# EAGLE design DeMuxRow (EAGLE 6.6.0)
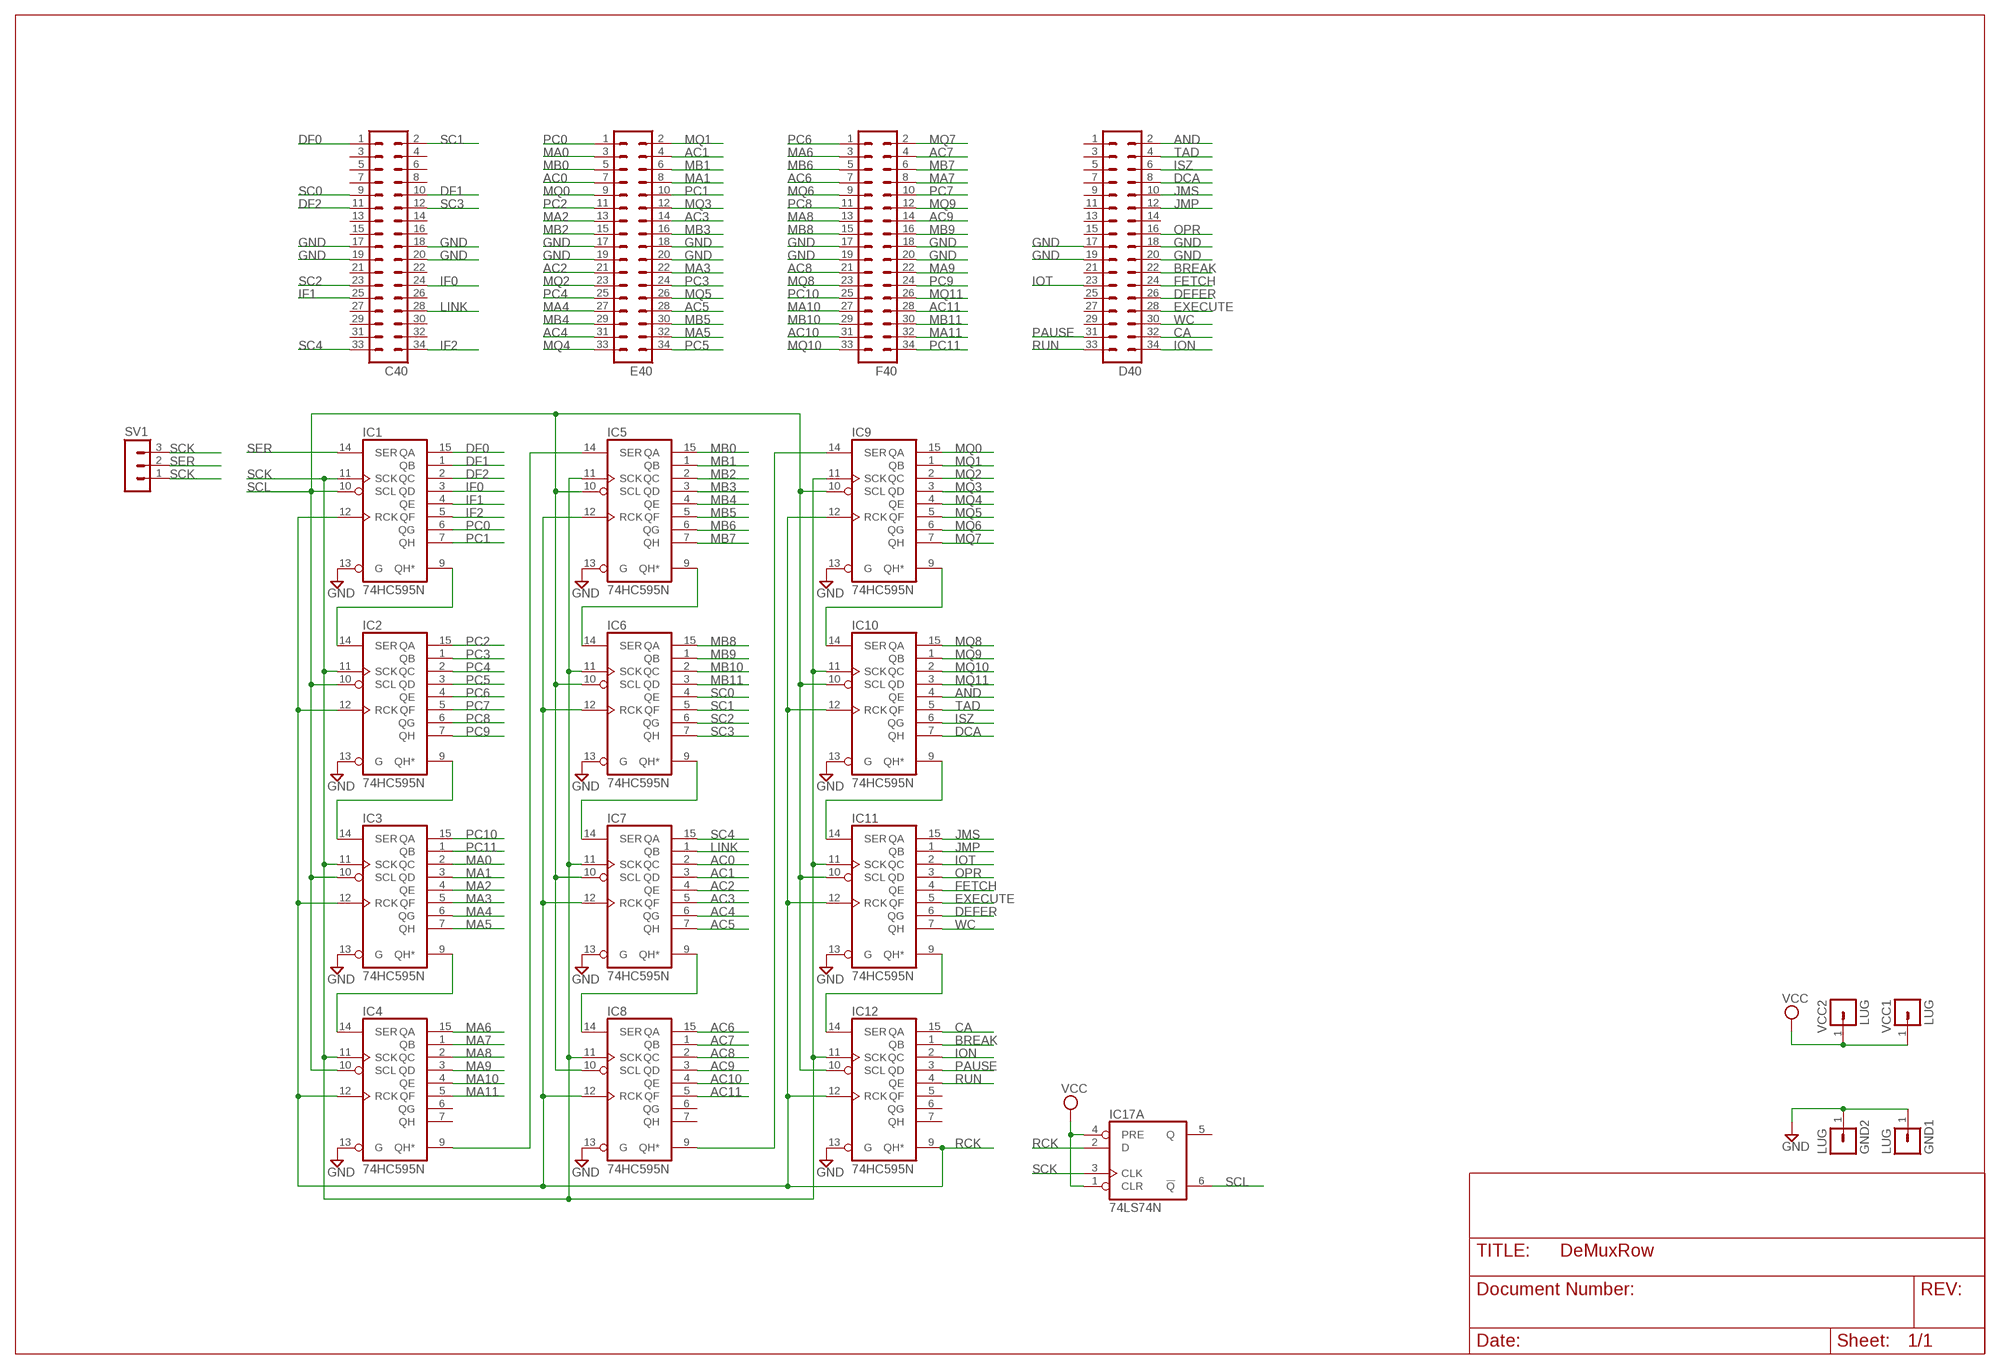
[diagram p0: schematic, sheet 1]

## Parts
C40  MA17-2  [MA17-2]
D40  MA17-2  [MA17-2]
E40  MA17-2  [MA17-2]
F40  MA17-2  [MA17-2]
GND1  LUG  [SPADELUG]
GND2  LUG  [SPADELUG]
IC1  74HC595N  74LS595N  [DIL16]
IC2  74HC595N  74LS595N  [DIL16]
IC3  74HC595N  74LS595N  [DIL16]
IC4  74HC595N  74LS595N  [DIL16]
IC5  74HC595N  74LS595N  [DIL16]
IC6  74HC595N  74LS595N  [DIL16]
IC7  74HC595N  74LS595N  [DIL16]
IC8  74HC595N  74LS595N  [DIL16]
IC9  74HC595N  74LS595N  [DIL16]
IC10  74HC595N  74LS595N  [DIL16]
IC11  74HC595N  74LS595N  [DIL16]
IC12  74HC595N  74LS595N  [DIL16]
IC17  74LS74N  [DIL14]
SV1  MA03-1  [MA03-1]
VCC1  LUG  [SPADELUG]
VCC2  LUG  [SPADELUG]

## Nets
AC0: E40.7 IC7.2(QC)
AC1: E40.4 IC7.3(QD)
AC2: E40.21 IC7.4(QE)
AC3: E40.14 IC7.5(QF)
AC4: E40.31 IC7.6(QG)
AC5: E40.28 IC7.7(QH)
AC6: F40.7 IC8.15(QA)
AC7: F40.4 IC8.1(QB)
AC8: F40.21 IC8.2(QC)
AC9: F40.14 IC8.3(QD)
AC10: F40.31 IC8.4(QE)
AC11: F40.28 IC8.5(QF)
AND: D40.2 IC10.4(QE)
BREAK: D40.22 IC12.1(QB)
CA: D40.32 IC12.15(QA)
DCA: D40.8 IC10.7(QH)
DEFER: D40.26 IC11.6(QG)
DF0: C40.1 IC1.15(QA)
DF1: C40.10 IC1.1(QB)
DF2: C40.11 IC1.2(QC)
EXECUTE: D40.28 IC11.5(QF)
FETCH: D40.24 IC11.4(QE)
GND [supply]: C40.17 C40.18 C40.19 C40.20 D40.17 D40.18 D40.19 D40.20 E40.17 E40.18 E40.19 E40.20 F40.17 F40.18 F40.19 F40.20 GND1.1 GND2.1 IC1.13(G) IC2.13(G) IC3.13(G) IC4.13(G) IC5.13(G) IC6.13(G) IC7.13(G) IC8.13(G) IC9.13(G) IC10.13(G) IC11.13(G) IC12.13(G)
IF0: C40.24 IC1.3(QD)
IF1: C40.25 IC1.4(QE)
IF2: C40.34 IC1.5(QF)
ION: D40.34 IC12.2(QC)
IOT: D40.23 IC11.2(QC)
ISZ: D40.6 IC10.6(QG)
JMP: D40.12 IC11.1(QB)
JMS: D40.10 IC11.15(QA)
LINK: C40.28 IC7.1(QB)
MA0: E40.3 IC3.2(QC)
MA1: E40.8 IC3.3(QD)
MA2: E40.13 IC3.4(QE)
MA3: E40.22 IC3.5(QF)
MA4: E40.27 IC3.6(QG)
MA5: E40.32 IC3.7(QH)
MA6: F40.3 IC4.15(QA)
MA7: F40.8 IC4.1(QB)
MA8: F40.13 IC4.2(QC)
MA9: F40.22 IC4.3(QD)
MA10: F40.27 IC4.4(QE)
MA11: F40.32 IC4.5(QF)
MB0: E40.5 IC5.15(QA)
MB1: E40.6 IC5.1(QB)
MB2: E40.15 IC5.2(QC)
MB3: E40.16 IC5.3(QD)
MB4: E40.29 IC5.4(QE)
MB5: E40.30 IC5.5(QF)
MB6: F40.5 IC5.6(QG)
MB7: F40.6 IC5.7(QH)
MB8: F40.15 IC6.15(QA)
MB9: F40.16 IC6.1(QB)
MB10: F40.29 IC6.2(QC)
MB11: F40.30 IC6.3(QD)
MQ0: E40.9 IC9.15(QA)
MQ1: E40.2 IC9.1(QB)
MQ2: E40.23 IC9.2(QC)
MQ3: E40.12 IC9.3(QD)
MQ4: E40.33 IC9.4(QE)
MQ5: E40.26 IC9.5(QF)
MQ6: F40.9 IC9.6(QG)
MQ7: F40.2 IC9.7(QH)
MQ8: F40.23 IC10.15(QA)
MQ9: F40.12 IC10.1(QB)
MQ10: F40.33 IC10.2(QC)
MQ11: F40.26 IC10.3(QD)
N$4: IC5.9(QH*) IC6.14(SER)
N$10: IC1.9(QH*) IC2.14(SER)
N$11: IC2.9(QH*) IC3.14(SER)
N$12: IC3.9(QH*) IC4.14(SER)
N$13: IC7.9(QH*) IC8.14(SER)
N$14: IC6.9(QH*) IC7.14(SER)
N$15: IC11.9(QH*) IC12.14(SER)
N$16: IC10.9(QH*) IC11.14(SER)
N$19: IC9.9(QH*) IC10.14(SER)
N$21: IC4.9(QH*) IC5.14(SER)
N$22: IC8.9(QH*) IC9.14(SER)
OPR: D40.16 IC11.3(QD)
PAUSE: D40.31 IC12.3(QD)
PC0: E40.1 IC1.6(QG)
PC1: E40.10 IC1.7(QH)
PC2: E40.11 IC2.15(QA)
PC3: E40.24 IC2.1(QB)
PC4: E40.25 IC2.2(QC)
PC5: E40.34 IC2.3(QD)
PC6: F40.1 IC2.4(QE)
PC7: F40.10 IC2.5(QF)
PC8: F40.11 IC2.6(QG)
PC9: F40.24 IC2.7(QH)
PC10: F40.25 IC3.15(QA)
PC11: F40.34 IC3.1(QB)
RCK: IC1.12(RCK) IC2.12(RCK) IC3.12(RCK) IC4.12(RCK) IC5.12(RCK) IC6.12(RCK) IC7.12(RCK) IC8.12(RCK) IC9.12(RCK) IC10.12(RCK) IC11.12(RCK) IC12.9(QH*) IC12.12(RCK) IC17.2(A:D)
RUN: D40.33 IC12.4(QE)
SC0: C40.9 IC6.4(QE)
SC1: C40.2 IC6.5(QF)
SC2: C40.23 IC6.6(QG)
SC3: C40.12 IC6.7(QH)
SC4: C40.33 IC7.15(QA)
SCK: IC1.11(SCK) IC2.11(SCK) IC3.11(SCK) IC4.11(SCK) IC5.11(SCK) IC6.11(SCK) IC7.11(SCK) IC8.11(SCK) IC9.11(SCK) IC10.11(SCK) IC11.11(SCK) IC12.11(SCK) IC17.3(A:CLK) SV1.1 SV1.3
SCL: IC1.10(SCL) IC2.10(SCL) IC3.10(SCL) IC4.10(SCL) IC5.10(SCL) IC6.10(SCL) IC7.10(SCL) IC8.10(SCL) IC9.10(SCL) IC10.10(SCL) IC11.10(SCL) IC12.10(SCL) IC17.6(A:!Q)
SER: IC1.14(SER) SV1.2
TAD: D40.4 IC10.5(QF)
VCC [supply]: IC17.1(A:CLR) IC17.4(A:PRE) VCC1.1 VCC2.1
WC: D40.30 IC11.7(QH)
Unconnected: C40.3 C40.4 C40.5 C40.6 C40.7 C40.8 C40.13 C40.14 C40.15 C40.16 C40.21 C40.22 C40.26 C40.27 C40.29 C40.30 C40.31 C40.32 D40.1 D40.3 D40.5 D40.7 D40.9 D40.11 D40.13 D40.14 D40.15 D40.21 D40.25 D40.27 D40.29 IC4.6(QG) IC4.7(QH) IC8.6(QG) IC8.7(QH) IC12.5(QF) IC12.6(QG) IC12.7(QH) IC17.5(A:Q) IC17.8(B:!Q) IC17.9(B:Q) IC17.10(B:PRE) IC17.11(B:CLK) IC17.12(B:D) IC17.13(B:CLR)

## Power pins joined to a net without a drawn wire
GND: IC1.8(GND) IC2.8(GND) IC3.8(GND) IC4.8(GND) IC5.8(GND) IC6.8(GND) IC7.8(GND) IC8.8(GND) IC9.8(GND) IC10.8(GND) IC11.8(GND) IC12.8(GND) IC17.7(P:GND)
VCC: IC1.16(VCC) IC2.16(VCC) IC3.16(VCC) IC4.16(VCC) IC5.16(VCC) IC6.16(VCC) IC7.16(VCC) IC8.16(VCC) IC9.16(VCC) IC10.16(VCC) IC11.16(VCC) IC12.16(VCC) IC17.14(P:VCC)

## Library data of the parts
C40 D40 E40 F40 = con-lstb:MA17-2: PIN HEADER; OC_FARNELL: unknown; OC_NEWARK: unknown
GND1 GND2 VCC1 VCC2 = dec-con:LUG: Spade Lug
IC1-IC12 = 74xx-us:74*595: 8-bit SHIFT REGISTER, output latch
IC17 = 74xx-us:74*74: Dual D type positive edge triggered FLIP FLOP, preset and clear
SV1 = con-lstb:MA03-1: PIN HEADER; OC_FARNELL: unknown; OC_NEWARK: unknown

## Net classes
1 supply: width 0.762 mm

## Board
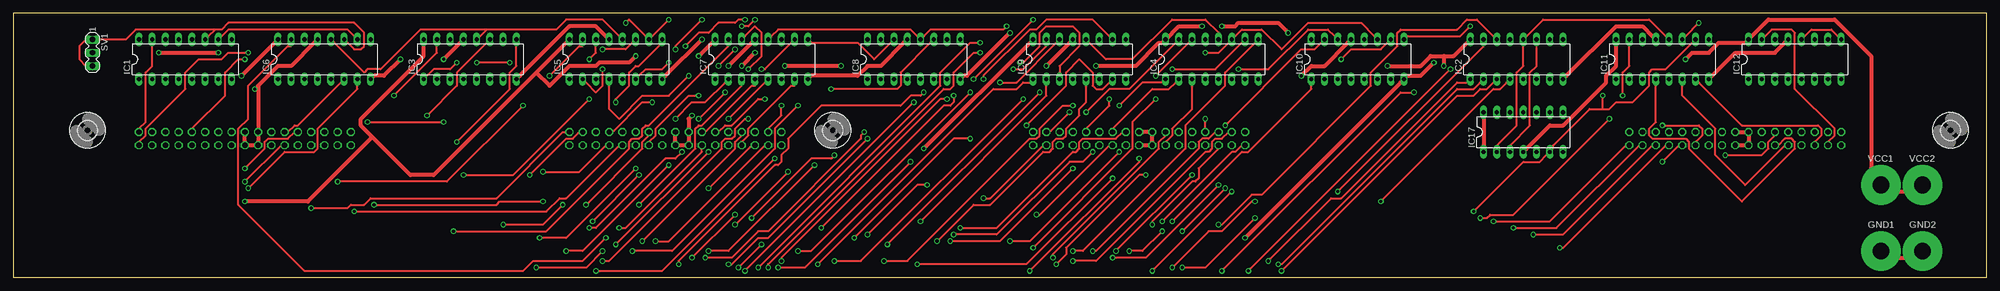
[diagram p1: board, top side]
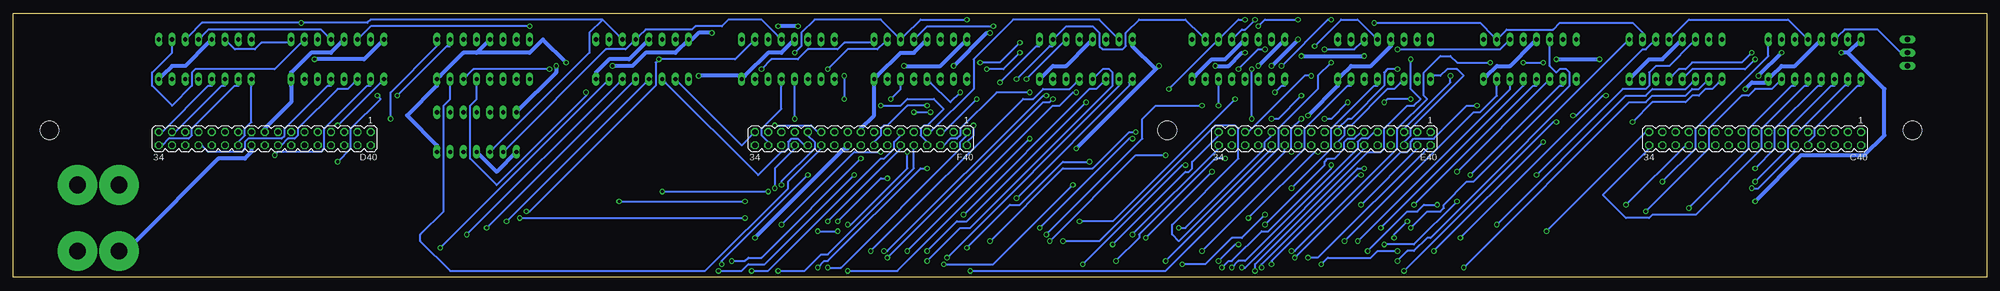
[diagram p2: board, bottom side, seen from below]

Size 378.46 x 50.8 mm. Coordinates in mm from the lower left corner, seen from the top.
Outline: 378.46,0 378.46,50.8 0,50.8 0,0 378.46,0
Copper layers (1*16): Top 0.035mm / dielectric 1.5mm / Bottom 0.035mm
Design rules "15mils": minimum track width 15mil, minimum drill 24mil, track to track 15mil, track to pad 10mil, pad to pad 10mil, via to via 10mil, smd to smd 10mil, copper to edge 25mil, drill to drill 10mil, minimum pad ring 10mil, minimum via ring 8mil, stop-mask expansion 0mil, vias tented up to drill 0mil, thermal gap 10mil

### Footprints (pad centres in the part's own frame; a part is rotated, then mirrored left to right if it is on the bottom)
MA17-2 = drill 1.016 octagon: 1 -20.32,-1.27; 2 -20.32,1.27; 3 -17.78,-1.27; 4 -17.78,1.27; 5 -15.24,-1.27; 6 -15.24,1.27; 7 -12.7,-1.27; 8 -12.7,1.27; 9 -10.16,-1.27; 10 -10.16,1.27; 11 -7.62,-1.27; 12 -7.62,1.27; 13 -5.08,-1.27; 14 -5.08,1.27; 15 -2.54,-1.27; 16 -2.54,1.27; 17 0,-1.27; 18 0,1.27; 19 2.54,-1.27; 20 2.54,1.27; 21 5.08,-1.27; 22 5.08,1.27; 23 7.62,-1.27; 24 7.62,1.27; 25 10.16,-1.27; 26 10.16,1.27; 27 12.7,-1.27; 28 12.7,1.27; 29 15.24,-1.27; 30 15.24,1.27; 31 17.78,-1.27; 32 17.78,1.27; 33 20.32,-1.27; 34 20.32,1.27
SPADELUG = drill 3.175 pad 7.62: 1 0,0
DIL16 = drill 0.813 long: 1 -8.89,-3.81; 2 -6.35,-3.81; 3 -3.81,-3.81; 4 -1.27,-3.81; 5 1.27,-3.81; 6 3.81,-3.81; 7 6.35,-3.81; 8 8.89,-3.81; 9 8.89,3.81; 10 6.35,3.81; 11 3.81,3.81; 12 1.27,3.81; 13 -1.27,3.81; 14 -3.81,3.81; 15 -6.35,3.81; 16 -8.89,3.81
DIL14 = drill 0.813 long: 1 -7.62,-3.81; 2 -5.08,-3.81; 3 -2.54,-3.81; 4 0,-3.81; 5 2.54,-3.81; 6 5.08,-3.81; 7 7.62,-3.81; 8 7.62,3.81; 9 5.08,3.81; 10 2.54,3.81; 11 0,3.81; 12 -2.54,3.81; 13 -5.08,3.81; 14 -7.62,3.81
MA03-1 = drill 1.016 long: 1 -2.54,0; 2 0,0; 3 2.54,0
3,6 = hole 3.6: 0,0

### Placement (x,y rotation side)
C40  44.45,26.67 180 bottom
D40  330.2,26.67 180 bottom
E40  127,26.67 180 bottom
F40  215.9,26.67 180 bottom
GND1  358.14,5.08 0 top
GND2  366.08,5.08 0 top
IC1  33.02,41.91 0 top
IC2  288.29,41.91 0 top
IC3  87.63,41.91 0 top
IC4  229.87,41.91 0 top
IC5  115.57,41.91 0 top
IC6  59.69,41.91 0 top
IC7  143.51,41.91 0 top
IC8  172.72,41.91 0 top
IC9  204.47,41.91 0 top
IC10  257.81,41.91 0 top
IC11  316.23,41.91 0 top
IC12  341.63,41.91 0 top
IC17  289.56,27.94 0 top
SV1  15.24,43.18 270 top
U$5  [3,6]  371.48,28.26 0 top
U$9  [3,6]  14.29,28.26 0 top
U$11  [3,6]  157.16,28.26 0 top
VCC1  358.14,17.78 0 top
VCC2  366.08,17.78 0 top

### Tracks (layer width: path | path; a pad name or v marks a point on that pad's centre or on a via)
AC0  (via drill 0.61)
  Top 0.381: v127,30.48 130.18,33.66 132.72,33.66 136.53,37.47 IC7.2 | v122.56,33.66 120.65,33.66 114.94,27.94 E40.7
  Bottom 0.381: v127,30.48 125.73,30.48 v122.56,33.66
AC1  (via drill 0.61)
  Top 0.381: v120.02,13.97 130.81,24.77 130.81,28.57 131.44,29.21 132.08,29.21 139.7,36.83 IC7.3
  Bottom 0.381: v120.02,13.97 109.22,24.77 E40.4
AC2
  Top 0.381: IC7.4 142.24,36.83 141.6,36.83 132.72,27.94 E40.21
AC3  (via drill 0.61)
  Top 0.381: v137.16,30.48 144.15,37.47 IC7.5 | v131.44,34.92 129.54,34.92 123.19,28.57 123.19,27.3 121.92,26.04 E40.14
  Bottom 0.381: v137.16,30.48 135.89,30.48 v131.44,34.92
AC4  (via drill 0.61)
  Top 0.381: v147.32,33.02 147.32,31.11 144.78,28.57 E40.31
  Bottom 0.381: v147.32,33.02 147.32,36.83 IC7.6
AC5
  Top 0.381: IC7.7 149.86,36.83 149.22,36.83 140.97,28.57 140.97,27.3 139.7,26.04 E40.28
AC6
  Bottom 0.381: IC8.15 167,46.35 170.18,49.53 186.69,49.53 194.31,41.91 194.31,36.2 202.56,27.94 F40.7
AC7  (via drill 0.61)
  Top 0.381: v186.06,15.24 187.32,15.24 197.49,25.4 F40.4
  Bottom 0.381: v186.06,15.24 164.47,36.83 164.47,37.47 IC8.1
AC8  (via drill 0.61)
  Top 0.381: v199.39,3.81 199.39,4.45 219.71,24.77 219.71,26.04 220.98,27.3 F40.21
  Bottom 0.381: v199.39,3.81 166.37,36.83 IC8.2
AC9  (via drill 0.61)
  Top 0.381: v196.22,12.06 196.85,12.06 210.19,25.4 F40.14
  Bottom 0.381: v196.22,12.06 172.09,36.2 170.81,36.2 169.54,37.47 IC8.3
AC10  (via drill 0.61)
  Top 0.381: v203.2,3.17 207.65,3.17 228.6,24.13 229.24,24.13 229.87,24.77 229.87,26.04 230.5,26.67 231.78,26.67 233.04,27.94 F40.31
  Bottom 0.381: v203.2,3.17 196.85,9.53 194.94,9.53 167.64,36.83 167.64,39.37 168.28,40.01 169.54,40.01 170.81,38.73 IC8.4
AC11  (via drill 0.61)
  Top 0.381: v214,5.08 216.53,5.08 v220.34,8.89 | v232.41,17.14 v224.16,8.89
  Bottom 0.381: v214,5.08 184.78,34.29 182.88,34.29 180.97,36.2 175.9,36.2 174.62,37.47 IC8.5 | v224.16,8.89 v220.34,8.89 | v232.41,17.14 232.41,20.95 228.6,24.77 F40.28
AND  (via drill 0.61)
  Top 0.381: v283.85,10.79 294.64,10.79 309.25,25.4 D40.2
  Bottom 0.381: v283.85,10.79 257.18,37.47 IC10.4
BREAK
  Bottom 0.381: IC12.1 332.74,36.83 332.74,29.84 334.01,28.57 334.01,27.3 335.28,26.04 D40.22
CA
  Top 0.381: IC12.15 335.92,46.35 337.19,47.62 341,47.62 341.63,46.99 341.63,36.2 349.25,28.57 349.25,27.3 347.98,26.04 D40.32
DCA  (via drill 0.61)
  Top 0.381: v296.55,5.71 297.18,5.71 316.87,25.4 D40.8
  Bottom 0.381: v296.55,5.71 264.8,37.47 IC10.7
DEFER
  Top 0.381: IC11.6 320.04,36.83 320.04,34.92 326.39,28.57 326.39,23.5 332.11,17.78 339.73,25.4 D40.26
DF0
  Top 0.381: IC1.15 26.67,44.45 26.67,40.64 25.4,39.37 25.4,29.84 24.13,28.57 C40.1
DF1
  Bottom 0.381: IC1.1 24.13,36.83 24.77,36.83 33.02,28.57 33.02,27.3 34.29,26.04 C40.10
DF2
  Bottom 0.381: IC1.2 26.67,36.83 27.3,36.83 36.2,27.94 C40.11
EXECUTE
  Bottom 0.381: IC11.5 317.5,36.83 318.13,36.83 326.39,28.57 326.39,27.3 327.02,26.67 333.38,26.67 334.01,26.04 334.01,24.77 334.64,24.13 341,24.13 342.26,25.4 D40.28
FETCH
  Top 0.381: IC11.4 314.96,36.83 314.96,29.84 313.69,28.57 313.69,27.3 314.32,26.67 320.68,26.67 321.31,26.04 321.31,24.77 331.47,14.61 341.63,24.77 341.63,26.04 341,26.67 339.73,26.67 338.45,25.4 D40.24
GND  (via drill 0.61)
  Top 0.762: C40.17 44.45,27.3 44.45,26.04 C40.18 45.09,25.4 46.35,25.4 C40.20 46.99,26.04 46.99,27.3 C40.19 46.99,28.57 46.99,36.2 | 46.99,36.2 46.99,36.83 50.8,40.64 53.34,40.64 57.78,45.09 IC6.13 | 46.99,36.2 v46.35,36.2 | IC7.8 153.03,38.73 161.93,38.73 163.83,40.64 166.37,40.64 170.81,45.09 IC8.13 | E40.17 127,27.3 127,26.04 E40.18 127.64,25.4 128.91,25.4 E40.20 129.54,26.04 129.54,27.3 E40.19 129.54,28.57 129.54,30.48 v130.18,31.11 | IC3.8 97.16,38.73 106.68,48.26 111.76,48.26 113.67,46.35 IC5.13 | v137.16,40.64 141.6,45.09 IC7.13 | v132.08,45.72 125.09,38.73 IC5.8 | v74.3,41.91 71.12,38.73 69.22,38.73 IC6.8 | v82.55,41.91 85.72,45.09 IC3.13 | F40.18 216.53,25.4 217.81,25.4 F40.20 218.44,26.04 218.44,27.3 F40.19 217.81,27.94 216.53,27.94 F40.17 | v247.01,38.73 248.92,40.64 251.46,40.64 255.91,45.09 IC10.13 | v236.22,7.62 266.06,37.47 IC10.8 267.33,38.73 269.88,38.73 v272.42,41.27 | D40.17 330.83,27.94 332.11,27.94 D40.19 332.74,27.3 332.74,26.04 D40.20 332.11,25.4 330.83,25.4 D40.18 | IC12.13 339.73,45.09 337.82,43.18 330.2,43.18 325.75,38.73 IC11.8 | IC2.8 297.81,38.73 307.34,48.26 312.42,48.26 314.32,46.35 IC11.13 | v191.13,46.99 182.88,38.73 182.25,38.73 IC8.8 | v198.12,40.64 202.56,45.09 IC9.13 | GND2.1 362.58,3.81 361.31,3.81 GND1.1
  Bottom 0.762: IC1.13 32.38,45.09 36.83,40.64 39.37,40.64 41.27,38.73 IC1.8 42.55,37.47 45.09,37.47 v46.35,36.2 | IC6.8 67.94,38.73 64.77,41.91 62.23,41.91 59.05,45.09 IC6.13 | IC7.8 151.76,38.73 148.59,41.91 146.05,41.91 142.88,45.09 IC7.13 | IC8.8 180.97,38.73 179.07,40.64 176.53,40.64 172.09,45.09 IC8.13 | IC3.8 95.89,38.73 93.98,40.64 91.44,40.64 87,45.09 IC3.13 | IC5.13 114.3,44.45 118.11,40.64 121.92,40.64 123.83,38.73 IC5.8 124.46,36.83 v130.18,31.11 | v137.16,40.64 v132.08,45.72 | v82.55,41.91 v74.3,41.91 | F40.17 215.9,28.57 213.36,31.11 213.36,36.83 IC9.8 212.72,38.73 208.28,43.18 205.74,43.18 203.84,45.09 IC9.13 | IC4.13 229.24,45.09 231.14,43.18 233.68,43.18 238.12,38.73 IC4.8 239.4,38.73 v247.01,38.73 | IC10.8 266.7,39.37 264.16,41.91 260.35,41.91 257.18,45.09 IC10.13 | v236.22,7.62 219.07,24.77 218.44,24.77 F40.20 | IC17.7 297.18,25.4 302.89,31.11 297.18,36.83 IC2.8 296.55,38.73 292.1,43.18 289.56,43.18 | 289.56,43.18 287.65,45.09 IC2.13 | IC12.8 349.88,38.73 347.98,40.64 345.44,40.64 341,45.09 IC12.13 | D40.17 330.2,28.57 325.12,33.66 325.12,36.83 IC11.8 325.12,39.37 321.31,43.18 317.5,43.18 315.6,45.09 IC11.13 | v272.42,41.27 276.86,45.72 279.4,43.18 289.56,43.18 | v191.13,46.99 191.77,46.99 v198.12,40.64 | D40.20 332.74,24.77 332.74,24.13 334.01,22.86 339.09,22.86 354.96,6.99 GND1.1
IF0  (via drill 0.61)
  Top 0.381: v44.45,18.41 51.44,25.4 C40.24
  Bottom 0.381: v44.45,18.41 38.1,24.77 38.1,28.57 29.84,36.83 29.21,36.83 IC1.3
IF1  (via drill 0.61)
  Top 0.381: v44.45,20.95 48.26,24.77 48.26,26.04 48.9,26.67 52.7,26.67 53.98,27.94 C40.25
  Bottom 0.381: v44.45,20.95 40.64,24.77 40.64,28.57 32.38,36.83 31.75,36.83 IC1.4
IF2
  Bottom 0.381: IC1.5 34.29,36.83 34.92,36.83 43.18,28.57 43.18,24.77 55.88,12.06 64.14,12.06 64.77,11.43 69.22,11.43 73.66,15.88 64.77,24.77 C40.34
ION
  Bottom 0.381: IC12.2 335.28,36.83 335.92,36.83 344.17,28.57 344.17,27.3 344.81,26.67 348.62,26.67 349.88,25.4 D40.34
IOT  (via drill 0.61)
  Top 0.381: v328.3,23.5 335.28,23.5 336.55,24.77 336.55,26.04 337.82,27.3 D40.23
  Bottom 0.381: v328.3,23.5 327.66,24.13 319.4,24.13 318.77,24.77 318.77,28.57 310.51,36.83 309.88,36.83 IC11.2
ISZ  (via drill 0.61)
  Top 0.381: v291.46,8.26 297.18,8.26 314.32,25.4 D40.6
  Bottom 0.381: v291.46,8.26 262.25,37.47 IC10.6
JMP  (via drill 0.61)
  Top 0.381: v316.23,29.21 323.21,29.21 323.85,28.57 323.85,27.3 322.58,26.04 D40.12
  Bottom 0.381: v316.23,29.21 307.98,37.47 IC11.1
JMS  (via drill 0.61)
  Top 0.381: v308.61,34.92 308.61,39.37 309.88,40.64 309.88,44.45 IC11.15 | v316.23,22.23 319.4,25.4 D40.10
  Bottom 0.381: v308.61,34.92 307.98,34.29 313.69,28.57 313.69,24.77 v316.23,22.23
LINK  (via drill 0.61)
  Top 0.381: v131.44,30.48 v136.53,35.56 | v115.57,6.35 v133.35,24.13 | v101.6,14.61 93.34,14.61 92.71,13.97 v69.22,13.97
  Bottom 0.381: v136.53,35.56 135.25,36.83 134.62,36.83 IC7.1 | v131.44,30.48 133.35,28.57 v133.35,24.13 | v115.57,6.35 109.86,6.35 v101.6,14.61 | v69.22,13.97 57.78,25.4 C40.28
MA0  (via drill 0.61)
  Top 0.381: v99.06,19.68 106.05,26.67 107.31,26.67 108.58,27.94 E40.3
  Bottom 0.381: v99.06,19.68 81.92,36.83 81.28,36.83 IC3.2
MA1  (via drill 0.61)
  Top 0.381: v101.6,20.32 108.58,20.32 113.67,25.4 E40.8
  Bottom 0.381: v101.6,20.32 84.45,37.47 IC3.3
MA2  (via drill 0.61)
  Top 0.381: v109.86,13.97 120.65,24.77 120.65,26.04 121.92,27.3 E40.13
  Bottom 0.381: v109.86,13.97 87,36.83 86.36,36.83 IC3.4
MA3  (via drill 0.61)
  Top 0.381: v116.2,9.53 117.47,9.53 132.08,24.13 132.08,24.77 E40.22
  Bottom 0.381: v116.2,9.53 88.9,36.83 IC3.5
MA4  (via drill 0.61)
  Top 0.381: v120.65,6.99 138.43,24.77 138.43,26.04 139.7,27.3 E40.27
  Bottom 0.381: v120.65,6.99 91.44,36.2 91.44,36.83 IC3.6
MA5  (via drill 0.61)
  Top 0.381: v123.19,6.99 125.73,6.99 144.15,25.4 E40.32
  Bottom 0.381: v123.19,6.99 98.42,31.75 97.16,31.75 93.98,34.92 93.98,36.83 IC3.7
MA6  (via drill 0.61)
  Top 0.381: v205.74,31.75 210.19,36.2 214,36.2 222.88,45.09 IC4.15 | v202.56,31.75 198.75,27.94 F40.3
  Bottom 0.381: v205.74,31.75 v202.56,31.75
MA7  (via drill 0.61)
  Top 0.381: v212.09,33.02 216.53,37.47 220.34,37.47 IC4.1
  Bottom 0.381: v212.09,33.02 208.28,33.02 207.01,34.29 201.93,34.29 200.03,32.38 203.2,29.21 203.84,29.21 204.47,28.57 204.47,27.3 203.2,26.04 F40.8
MA8
  Top 0.381: IC4.2 222.88,37.47 221.62,36.2 218.44,36.2 210.82,28.57 F40.13
MA9
  Top 0.381: IC4.3 226.06,36.83 226.06,32.38 222.25,28.57 222.25,27.3 220.98,26.04 F40.22
MA10  (via drill 0.61)
  Top 0.381: v228.6,30.48 228.6,28.57 F40.27
  Bottom 0.381: v228.6,30.48 228.6,36.83 IC4.4
MA11
  Bottom 0.381: IC4.5 231.14,36.83 231.14,32.38 234.95,28.57 234.95,27.3 233.68,26.04 F40.32
MB0  (via drill 0.61)
  Top 0.381: v102.87,38.73 108.58,44.45 109.22,44.45 IC5.15
  Bottom 0.381: v102.87,38.73 102.87,37.47 111.76,28.57 E40.5
MB1
  Bottom 0.381: IC5.1 106.05,38.73 104.78,38.73 103.5,40.01 101.6,40.01 100.33,38.73 110.49,28.57 110.49,27.3 111.76,26.04 E40.6
MB2  (via drill 0.61)
  Top 0.381: v113.03,40.01 113.03,36.83 111.76,35.56 109.86,37.47 IC5.2
  Bottom 0.381: v113.03,40.01 114.94,40.01 115.57,39.37 115.57,36.83 121.92,30.48 122.56,30.48 124.46,28.57 E40.15
MB3
  Bottom 0.381: IC5.3 112.39,37.47 113.67,36.2 114.94,36.2 121.92,29.21 122.56,29.21 123.19,28.57 123.19,27.3 124.46,26.04 E40.16
MB4  (via drill 0.61)
  Top 0.381: v129.54,38.73 125.73,34.92 120.65,34.92 116.2,30.48 114.3,32.38 114.3,36.83 IC5.4
  Bottom 0.381: v129.54,38.73 130.81,38.73 141.6,27.94 E40.29
MB5  (via drill 0.61)
  Top 0.381: v133.35,17.14 141.6,25.4 E40.30
  Bottom 0.381: v133.35,17.14 125.73,24.77 125.73,28.57 117.47,36.83 116.84,36.83 IC5.5
MB6  (via drill 0.61)
  Top 0.381: v125.73,41.27 124.46,40.01 121.28,40.01 120.02,38.73 IC5.6 | v157.48,3.17 162.56,3.17 v193.68,34.29
  Bottom 0.381: v125.73,41.27 128.27,38.73 128.27,36.2 135.89,28.57 135.89,24.77 v157.48,3.17 | v193.68,34.29 200.03,27.94 F40.5
MB7  (via drill 0.61)
  Top 0.381: v150.5,5.08 153.03,5.08 v183.51,35.56
  Bottom 0.381: v150.5,5.08 130.81,24.77 130.81,28.57 122.56,36.83 121.92,36.83 IC5.7 | v183.51,35.56 189.87,35.56 196.85,28.57 196.85,27.3 197.49,26.67 198.75,26.67 200.03,25.4 F40.6
MB8  (via drill 0.61)
  Top 0.381: v113.67,7.62 109.22,3.17 99.69,3.17 97.79,1.27 55.88,1.27 43.18,13.97 43.18,28.57 45.09,30.48 45.09,36.83 52.7,44.45 53.34,44.45 IC6.15 | v111.12,10.79 v120.02,19.68 | v137.16,2.54 137.79,2.54 142.88,7.62 144.78,7.62 v163.83,26.67 | v181.61,9.53 188.59,9.53 203.2,24.13 203.84,24.13 204.47,24.77 204.47,26.04 205.1,26.67 211.46,26.67 212.72,27.94 F40.15
  Bottom 0.381: v113.67,7.62 113.67,8.26 v111.12,10.79 | v120.02,19.68 120.65,19.68 137.16,3.17 v137.16,2.54 | v163.83,26.67 164.47,26.67 v181.61,9.53
MB9  (via drill 0.61)
  Top 0.381: v67.94,29.84 v82.55,29.84 | v111.76,1.27 124.46,1.27 v146.05,22.86 | v167,3.17 171.45,3.17 194.94,26.67 196.22,26.67 196.85,27.3 196.85,28.57 201.29,33.02 v203.2,33.02
  Bottom 0.381: v67.94,29.84 64.14,33.66 57.78,33.66 56.52,34.92 55.24,34.92 53.98,36.2 52.7,36.2 51.44,37.47 IC6.1 | v82.55,29.84 83.19,29.84 v111.76,1.27 | v146.05,22.86 147.96,22.86 162.56,8.26 162.56,7.62 v167,3.17 | v203.2,33.02 207.01,33.02 210.82,29.21 211.46,29.21 212.09,28.57 212.09,27.3 213.36,26.04 F40.16
MB10  (via drill 0.61)
  Top 0.381: v100.33,1.91 109.86,1.91 v113.03,5.08 | v127.64,2.54 127.64,3.17 146.05,21.59 146.69,21.59 147.32,22.23 147.32,23.5 148.59,24.77 148.59,26.67 154.94,33.02 170.18,33.02 172.09,34.92 173.99,34.92 v174.62,35.56 | v207.01,5.08 207.65,5.08 227.33,24.77 227.33,26.04 227.97,26.67 229.24,26.67 230.5,27.94 F40.29
  Bottom 0.381: v100.33,1.91 68.58,33.66 65.41,33.66 64.14,34.92 57.78,34.92 56.52,36.2 55.24,36.2 53.98,37.47 IC6.2 | v113.03,5.08 116.84,5.08 118.11,3.81 126.36,3.81 v127.64,2.54 | v174.62,35.56 175.26,35.56 177.8,33.02 179.07,33.02 v207.01,5.08
MB11  (via drill 0.61)
  Top 0.381: v93.98,10.16 101.6,10.16 v105.41,13.97 | v118.75,5.08 126.36,5.08 146.05,24.77 146.05,28.57 v150.5,33.02 | v180.34,8.26 188.59,8.26 202.56,22.23 205.1,22.23 v207.01,24.13 | v218.44,10.16 218.44,10.79 226.06,18.41 226.69,18.41 227.33,19.05 227.33,20.95 231.14,24.77 F40.30
  Bottom 0.381: v93.98,10.16 69.22,34.92 65.41,34.92 64.14,36.2 57.78,36.2 56.52,37.47 IC6.3 | v105.41,13.97 107.95,13.97 109.22,12.7 111.12,12.7 v118.75,5.08 | v150.5,33.02 159.38,33.02 161.93,30.48 161.93,26.67 v180.34,8.26 | v207.01,24.13 207.01,20.95 217.81,10.16 v218.44,10.16
MQ0  (via drill 0.61)
  Top 0.381: v191.77,40.01 193.68,40.01 198.12,44.45 IC9.15 | v185.42,43.18 184.15,43.18 180.34,39.37 180.34,36.83 179.71,36.2 178.44,36.2 144.78,2.54 v144.78,1.91
  Bottom 0.381: v191.77,40.01 188.59,40.01 v185.42,43.18 | v144.78,1.91 143.51,3.17 142.24,3.17 120.65,24.77 120.65,26.04 120.02,26.67 118.75,26.67 117.47,27.94 E40.9
MQ1  (via drill 0.61)
  Top 0.381: v154.31,2.54 187.96,36.2 192.41,36.2 193.68,37.47 194.94,37.47 IC9.1 | v130.18,3.81 v138.43,12.06
  Bottom 0.381: v154.31,2.54 149.86,2.54 144.78,7.62 142.88,7.62 v138.43,12.06 | v130.18,3.81 128.27,3.81 E40.2
MQ2  (via drill 0.61)
  Top 0.381: v173.99,10.79 198.12,34.92 198.12,36.83 IC9.2 | v144.15,34.29 142.88,34.29 137.79,29.21 136.53,29.21 135.25,27.94 E40.23
  Bottom 0.381: v173.99,10.79 167.64,10.79 v144.15,34.29
MQ3  (via drill 0.61)
  Top 0.381: v193.04,41.27 193.68,41.27 196.85,44.45 196.85,46.99 198.12,48.26 203.2,48.26 204.47,46.99 204.47,44.45 200.66,40.64 200.66,39.37 IC9.3 | v185.42,45.09 183.51,45.09 177.8,39.37 177.8,36.83 v142.88,1.91
  Bottom 0.381: v193.04,41.27 189.23,41.27 v185.42,45.09 | v142.88,1.91 142.24,1.91 119.38,24.77 E40.12
MQ4  (via drill 0.61)
  Top 0.381: v167.64,6.35 v196.85,35.56
  Bottom 0.381: v196.85,35.56 198.75,33.66 202.56,37.47 IC9.4 | v167.64,6.35 153.67,20.32 153.03,20.32 152.4,20.95 152.4,22.23 147.32,27.3 E40.33
MQ5  (via drill 0.61)
  Top 0.381: v177.16,6.99 184.15,13.97 187.32,13.97 197.49,24.13 198.75,24.13 199.39,24.77 199.39,26.04 200.03,26.67 201.29,26.67 201.93,27.3 201.93,28.57 204.47,31.11 204.47,32.38 205.74,33.66 205.74,36.83 IC9.5
  Bottom 0.381: v177.16,6.99 170.18,6.99 147.96,29.21 144.15,29.21 143.51,28.57 143.51,22.86 156.21,10.16 156.21,8.26 154.94,6.99 137.16,24.77 E40.26
MQ6  (via drill 0.61)
  Top 0.381: v210.19,34.29 210.19,33.02 205.74,28.57 F40.9
  Bottom 0.381: v210.19,34.29 208.28,36.2 208.28,36.83 IC9.6
MQ7  (via drill 0.61)
  Top 0.381: v194.31,29.21 201.93,36.83 201.93,39.37 204.47,41.91 207.01,39.37 207.01,36.83 207.65,36.2 208.91,36.2 210.19,37.47 IC9.7
  Bottom 0.381: v194.31,29.21 194.31,27.3 195.58,26.04 F40.2
MQ8  (via drill 0.61)
  Top 0.381: v232.41,29.21 247.01,43.81 249.56,43.81 250.82,45.09 IC10.15
  Bottom 0.381: v232.41,29.21 225.43,29.21 224.16,27.94 F40.23
MQ9  (via drill 0.61)
  Top 0.381: v222.25,10.79 235.59,24.13 236.85,24.13 248.92,36.2 248.92,36.83 IC10.1
  Bottom 0.381: v222.25,10.79 208.28,24.77 F40.12
MQ10
  Bottom 0.381: F40.33 238.76,25.4 250.82,37.47 IC10.2
MQ11
  Bottom 0.381: IC10.3 253.37,37.47 235.59,19.68 231.14,24.13 230.5,24.13 229.87,24.77 229.87,26.04 229.24,26.67 227.97,26.67 226.69,25.4 F40.26
N$4  (via drill 0.61)
  Top 0.381: v86.36,19.68 95.89,19.68 v110.49,34.29 | v115.57,33.66 115.57,34.29 118.11,36.83 118.11,39.37 119.38,40.64 120.02,40.64 124.46,45.09 IC5.9
  Bottom 0.381: v86.36,19.68 69.85,36.2 65.41,36.2 64.77,36.83 64.77,39.37 63.5,40.64 60.96,40.64 56.52,45.09 IC6.14 | v110.49,34.29 114.94,34.29 v115.57,33.66
N$10  (via drill 0.61)
  Top 0.381: v62.23,18.41 83.19,18.41 v97.79,33.02 | v132.72,3.81 137.79,3.81 142.88,8.89 144.78,8.89 162.56,26.67 162.56,27.3 v163.19,27.94 | v191.13,6.99 194.94,6.99 v212.09,24.13 | v231.14,10.16 231.78,10.16 237.49,15.88 239.4,15.88 260.35,36.83 260.35,39.37 265.43,44.45 265.43,46.99 266.06,47.62 276.86,47.62 278.76,49.53 280.67,49.53 283.85,46.35 IC2.14
  Bottom 0.381: v62.23,18.41 55.88,24.77 55.88,28.57 41.91,42.55 41.91,44.45 IC1.9 | v97.79,33.02 99.69,33.02 106.05,26.67 109.86,26.67 110.49,26.04 110.49,24.77 111.12,24.13 112.39,24.13 v132.72,3.81 | v163.19,27.94 164.47,27.94 171.45,20.95 177.16,20.95 v191.13,6.99 | v212.09,24.13 217.17,24.13 v231.14,10.16
N$11  (via drill 0.61)
  Top 0.381: v110.49,9.53 111.76,9.53 125.09,22.86 127,22.86 v128.27,24.13 | v141.6,11.43 153.03,22.86 156.84,22.86 v157.48,23.5 | v179.71,6.99 189.23,6.99 v203.2,20.95 | v224.16,1.91 228.6,1.91 v238.12,11.43 | v281.31,11.43 282.57,11.43 283.21,12.06 287.65,12.06 v306.07,30.48
  Bottom 0.381: v110.49,9.53 107.31,12.7 104.78,12.7 104.14,13.34 104.14,13.97 99.69,18.41 98.42,18.41 80.01,36.83 80.01,39.37 80.64,40.01 81.92,40.01 82.55,39.37 83.82,40.64 83.82,44.45 IC3.14 | v128.27,24.13 128.91,24.13 v141.6,11.43 | v157.48,23.5 163.19,23.5 v179.71,6.99 | v203.2,20.95 204.47,20.95 222.25,3.17 222.88,3.17 v224.16,1.91 | v281.31,11.43 v238.12,11.43 | v306.07,30.48 306.07,35.56 297.18,44.45 IC2.9
N$12  (via drill 0.61)
  Top 0.381: v85.09,26.04 95.25,36.2 95.25,39.37 96.52,40.64 96.52,44.45 IC3.9 | v106.05,5.08 109.22,5.08 v125.73,21.59 | v146.69,1.91 151.76,1.91 v172.09,22.23 | v195.58,5.71 214.63,24.77 214.63,29.84 v219.07,34.29 | v219.07,38.73 225.43,45.09 IC4.14
  Bottom 0.381: v106.05,5.08 v85.09,26.04 | v125.73,21.59 125.73,20.95 137.79,8.89 139.06,8.89 144.78,3.17 145.41,3.17 v146.69,1.91 | v172.09,22.23 177.16,22.23 185.42,13.97 187.32,13.97 v195.58,5.71 | v219.07,38.73 v219.07,34.29
N$13
  Top 0.381: IC7.9 153.03,45.09 161.93,45.09 165.1,41.91 168.28,45.09 IC8.14
N$14  (via drill 0.61)
  Top 0.381: v113.03,3.17 114.3,3.17 135.89,24.77 135.89,26.04 136.53,26.67 137.79,26.67 138.43,27.3 138.43,28.57 140.34,30.48 v140.97,30.48 | v140.97,40.01 143.51,42.55 143.51,46.99 142.24,48.26 140.34,46.35 IC7.14
  Bottom 0.381: v113.03,3.17 111.12,5.08 109.86,5.08 107.31,7.62 106.68,7.62 69.22,45.09 IC6.9 | v140.97,30.48 v140.97,40.01
N$15
  Bottom 0.381: IC11.9 325.75,45.09 330.83,45.09 332.11,43.81 335.92,43.81 337.19,45.09 IC12.14
N$16  (via drill 0.61)
  Top 0.381: v279.4,48.26 277.5,46.35 267.33,46.35 IC10.9
  Bottom 0.381: v279.4,48.26 309.88,48.26 311.79,46.35 IC11.14
N$19  (via drill 0.61)
  Top 0.381: v234.95,40.01 240.66,40.01 248.28,47.62 252.09,47.62 253.37,46.35 IC10.14
  Bottom 0.381: v234.95,40.01 233.04,41.91 227.97,41.91 226.06,43.81 220.34,43.81 219.07,45.09 214,45.09 IC9.9
N$21  (via drill 0.61)
  Top 0.381: v110.49,41.91 111.76,43.18 111.76,44.45 IC5.14 | v172.72,33.66 v140.34,1.27 | v203.2,5.08 205.1,5.08 224.79,24.77 224.79,29.21 232.41,36.83 232.41,39.37 238.12,45.09 IC4.9
  Bottom 0.381: v110.49,41.91 110.49,36.2 108.58,34.29 109.86,33.02 111.12,33.02 115.57,28.57 115.57,24.77 116.2,24.13 118.75,24.13 140.34,2.54 v140.34,1.27 | v172.72,33.66 195.58,10.79 197.49,10.79 v203.2,5.08
N$22  (via drill 0.61)
  Top 0.381: v189.23,37.47 192.41,37.47 200.03,45.09 IC9.14
  Bottom 0.381: v189.23,37.47 182.25,44.45 181.61,44.45 IC8.9
OPR
  Bottom 0.381: IC11.3 313.06,37.47 314.32,36.2 316.23,36.2 323.85,28.57 323.85,27.3 324.49,26.67 325.75,26.67 327.02,25.4 D40.16
PAUSE
  Bottom 0.381: IC12.3 337.82,36.83 338.45,36.83 347.35,27.94 D40.31
PC0  (via drill 0.61)
  Top 0.381: v57.15,13.34 64.14,13.34 64.77,13.97 67.31,13.97 68.58,15.24 92.71,15.24 105.41,27.94 106.05,27.94 E40.1
  Bottom 0.381: v57.15,13.34 45.72,24.77 45.72,28.57 37.47,36.83 36.83,36.83 IC1.6
PC1  (via drill 0.61)
  Top 0.381: v65.41,12.7 102.23,12.7 104.78,15.24 106.05,15.24 116.2,25.4 E40.10
  Bottom 0.381: v65.41,12.7 53.34,24.77 53.34,28.57 46.99,34.92 45.72,34.92 44.45,36.2 41.27,36.2 40.01,37.47 IC1.7
PC2  (via drill 0.61)
  Top 0.381: v254,16.51 281.94,44.45 IC2.15 | v233.68,16.51 v218.44,1.27 | v183.51,26.67 180.34,26.67 v161.29,7.62 | v148.59,20.32 v138.43,10.16
  Bottom 0.381: v254,16.51 v233.68,16.51 | v218.44,1.27 208.91,1.27 v183.51,26.67 | v161.29,7.62 v148.59,20.32 | v138.43,10.16 127,21.59 127,22.23 126.36,22.86 125.09,22.86 123.19,24.77 123.19,26.04 122.56,26.67 121.28,26.67 120.02,27.94 E40.11
PC3  (via drill 0.61)
  Top 0.381: v240.66,3.17 252.73,15.24 254.63,15.24 276.86,37.47 278.76,37.47 IC2.1 | v215.9,22.86 215.9,22.23 v194.94,1.27
  Bottom 0.381: v240.66,3.17 238.12,3.17 237.49,3.81 234.95,3.81 v215.9,22.86 | v194.94,1.27 157.48,1.27 134.62,24.13 134.62,24.77 E40.24
PC4  (via drill 0.61)
  Top 0.381: v242.57,2.54 243.21,2.54 276.86,36.2 280.04,36.2 281.31,37.47 IC2.2 | v226.06,19.68 v211.46,5.08 | v180.34,34.92 180.34,33.66 179.71,33.02 178.44,33.02 v154.94,9.53
  Bottom 0.381: v242.57,2.54 242.57,3.17 v226.06,19.68 | v211.46,5.08 210.82,5.08 180.97,34.92 v180.34,34.92 | v154.94,9.53 153.67,9.53 138.43,24.77 138.43,26.04 137.16,27.3 E40.25
PC5  (via drill 0.61)
  Top 0.381: v243.21,1.27 276.86,34.92 280.04,34.92 281.31,36.2 282.57,36.2 283.85,37.47 IC2.3 | v217.17,19.68 215.9,19.68 201.93,5.71 201.93,4.45 v200.03,2.54 | v175.26,17.78 173.35,17.78 v163.83,8.26
  Bottom 0.381: v243.21,1.27 238.76,1.27 237.49,2.54 234.31,2.54 v217.17,19.68 | v200.03,2.54 190.5,2.54 v175.26,17.78 | v163.83,8.26 147.32,24.77 E40.34
PC6  (via drill 0.61)
  Top 0.381: v262.25,14.61 283.85,36.2 285.12,36.2 286.38,37.47 IC2.4 | v238.12,14.61 237.49,14.61 231.78,8.89 229.24,8.89 v222.25,1.91
  Bottom 0.381: v262.25,14.61 v238.12,14.61 | v222.25,1.91 219.71,1.91 196.85,24.77 196.85,26.04 195.58,27.3 F40.1
PC7  (via drill 0.61)
  Top 0.381: v268.61,35.56 266.06,35.56 v231.78,1.27
  Bottom 0.381: v268.61,35.56 268.61,34.92 285.75,17.78 290.83,22.86 290.83,33.02 289.56,34.29 289.56,36.83 IC2.5 | v231.78,1.27 226.69,1.27 223.52,4.45 222.25,4.45 205.74,20.95 205.74,24.77 F40.10
PC8  (via drill 0.61)
  Top 0.381: v275.59,40.01 v236.85,1.27
  Bottom 0.381: v275.59,40.01 290.19,40.01 291.46,38.73 IC2.6 | v236.85,1.27 233.68,1.27 212.09,22.86 211.46,22.86 209.55,24.77 209.55,26.04 208.28,27.3 F40.11
PC9
  Bottom 0.381: IC2.7 294.64,36.83 294.64,34.29 295.91,33.02 295.91,12.7 300.36,8.26 300.36,6.99 294.64,1.27 245.75,1.27 229.87,17.14 229.87,18.41 223.52,24.77 F40.24
PC10  (via drill 0.61)
  Top 0.381: v73.03,34.92 81.28,43.18 81.28,44.45 IC3.15 | v100.97,7.62 106.05,7.62 v119.38,20.95 | v143.51,6.35 v139.06,1.91 | v147.32,3.17 147.32,3.81 177.8,34.29 v179.07,34.29 | v210.82,3.81 217.17,3.81 v231.14,17.78
  Bottom 0.381: v73.03,34.92 73.66,34.92 v100.97,7.62 | v119.38,20.95 120.65,20.95 139.06,2.54 v139.06,1.91 | v143.51,6.35 144.15,6.35 v147.32,3.17 | v179.07,34.29 179.71,33.66 180.97,33.66 v210.82,3.81 | v231.14,17.78 231.14,18.41 224.79,24.77 224.79,26.04 226.06,27.3 F40.25
PC11  (via drill 0.61)
  Top 0.381: v85.09,41.27 83.82,40.01 80.64,40.01 79.38,38.73 IC3.1 | v95.25,41.27 v88.9,41.27 | v133.35,5.08 137.16,5.08 v153.67,21.59 | v173.35,2.54 194.31,2.54 v210.82,19.05 | v220.34,10.79 233.68,24.13 234.31,24.13 235.59,25.4 F40.34
  Bottom 0.381: v88.9,41.27 v85.09,41.27 | v95.25,41.27 101.6,41.27 102.87,42.55 104.78,42.55 107.95,39.37 107.95,34.92 107.31,34.29 113.03,28.57 113.03,24.77 132.72,5.08 v133.35,5.08 | v153.67,21.59 154.31,21.59 v173.35,2.54 | v210.82,19.05 212.09,19.05 v220.34,10.79
RCK  (via drill 0.61)
  Top 0.381: IC12.9 349.88,46.35 348.62,47.62 344.81,47.62 343.54,46.35 IC12.12 | IC17.2 284.48,25.4 288.29,29.21 288.29,39.37 289.56,40.64 289.56,44.45 IC2.12 290.19,46.35 293.37,49.53 313.69,49.53 316.87,46.35 IC11.12 | 90.81,47.62 89.53,46.35 IC3.12 | 90.81,47.62 104.14,47.62 106.05,49.53 113.03,49.53 116.2,46.35 IC5.12 | 90.81,47.62 78.11,47.62 70.48,40.01 67.94,40.01 67.31,39.37 61.59,45.09 IC6.12 | IC7.12 145.41,46.35 146.69,47.62 172.09,47.62 173.35,46.35 IC8.12 174.62,46.35 175.9,47.62 189.87,47.62 v190.5,48.26 | IC9.12 206.38,45.09 209.55,41.91 214.63,41.91 222.25,49.53 228.6,49.53 231.14,46.99 IC4.12 | v128.91,44.45 131.44,46.99 133.35,46.99 135.25,48.9 138.43,48.9 139.06,49.53 v140.34,49.53
  Bottom 0.381: IC11.12 318.13,46.35 319.4,47.62 341,47.62 342.26,46.35 IC12.12 | IC17.2 283.85,24.77 264.8,43.81 260.99,43.81 259.71,45.09 IC10.12 258.44,46.35 257.18,47.62 248.28,47.62 247.65,48.26 242.57,48.26 241.3,49.53 234.95,49.53 231.78,46.35 IC4.12 | IC1.12 34.92,46.35 38.1,49.53 57.15,49.53 60.33,46.35 IC6.12 | v190.5,48.26 203.2,48.26 205.1,46.35 IC9.12 | v128.91,44.45 123.83,49.53 120.65,49.53 117.47,46.35 IC5.12 | v140.34,49.53 142.24,47.62 142.88,47.62 144.15,46.35 IC7.12
RUN
  Bottom 0.381: IC12.4 340.36,36.83 341,36.83 349.88,27.94 D40.33
SC0  (via drill 0.61)
  Top 0.381: v44.45,41.91 43.18,41.91 40.64,39.37 40.64,34.92 34.29,28.57 C40.9
  Bottom 0.381: v44.45,41.91 46.35,40.01 56.52,40.01 57.78,38.73 IC6.4
SC1  (via drill 0.61)
  Top 0.381: v45.09,43.18 41.27,43.18 40.01,41.91 35.56,41.91 33.02,39.37 33.02,36.2 25.4,28.57 25.4,27.3 24.13,26.04 C40.2
  Bottom 0.381: v45.09,43.18 46.99,41.27 56.52,41.27 57.78,40.01 59.05,40.01 60.33,38.73 IC6.5
SC2
  Top 0.381: IC6.6 62.87,37.47 54.61,29.21 53.98,29.21 52.7,27.94 C40.23
SC3  (via drill 0.61)
  Top 0.381: v45.09,17.14 52.07,24.13 57.78,24.13 58.42,24.77 58.42,28.57 66.04,36.2 66.04,36.83 IC6.7
  Bottom 0.381: v45.09,17.14 43.81,17.14 36.83,24.13 36.83,24.77 C40.12
SC4  (via drill 0.61)
  Top 0.381: v84.45,8.89 102.23,8.89 118.11,24.77 118.11,26.04 118.75,26.67 120.02,26.67 120.65,27.3 120.65,28.57 121.28,29.21 121.92,29.21 137.16,44.45 IC7.15
  Bottom 0.381: v84.45,8.89 65.41,27.94 C40.33
SCK  (via drill 0.61)
  Top 0.381: v113.03,43.81 117.47,43.81 118.75,45.09 IC5.11 | 38.73,47.62 37.47,46.35 IC1.11 | 38.73,47.62 40.01,47.62 41.27,48.9 65.41,48.9 67.31,46.99 67.31,44.45 66.67,43.81 65.41,43.81 64.14,45.09 IC6.11 | v79.38,31.11 85.09,36.83 85.09,39.37 90.81,45.09 IC3.11 | v156.84,36.2 169.54,36.2 170.18,36.83 170.18,39.37 175.9,45.09 IC8.11 | v228.6,43.18 231.14,43.18 233.04,45.09 IC4.11 234.31,46.35 235.59,47.62 239.4,47.62 243.21,43.81 248.28,48.9 258.44,48.9 260.99,46.35 IC10.11 | v323.21,48.9 320.68,46.35 IC11.11 | IC2.11 292.1,44.45 292.1,40.64 290.83,39.37 290.83,29.21 287.02,25.4 IC17.3 | v195.58,49.53 v184.15,38.1 | v127,43.81 127,44.45 v132.08,49.53 | v139.7,48.26 140.97,48.26 v142.24,49.53 | SV1.3 13.97,40.64 12.7,41.91 12.7,44.45 13.97,45.72 SV1.1 16.51,45.72 21.59,45.72 23.5,47.62 38.73,47.62
  Bottom 0.381: v113.03,43.81 93.34,43.81 92.08,45.09 IC3.11 | v79.38,31.11 78.74,31.11 66.04,43.81 65.41,43.81 64.14,45.09 IC6.11 | v156.84,36.2 147.96,45.09 IC7.11 146.69,46.35 143.51,49.53 v142.24,49.53 | v228.6,43.18 227.33,44.45 227.33,46.99 224.79,49.53 212.09,49.53 208.91,46.35 IC9.11 207.65,46.35 204.47,49.53 v195.58,49.53 | IC12.11 344.81,46.35 342.26,48.9 v323.21,48.9 310.51,48.9 309.88,49.53 265.43,49.53 | 265.43,49.53 262.25,46.35 IC10.11 | 265.43,49.53 267.97,46.99 267.97,43.18 286.38,24.77 IC17.3 | v184.15,38.1 177.16,45.09 IC8.11 | v127,43.81 121.28,43.81 120.02,45.09 IC5.11 | v132.08,49.53 138.43,49.53 v139.7,48.26
SCL  (via drill 0.61)
  Top 0.381: IC1.10 40.01,46.35 41.27,47.62 64.14,47.62 65.41,46.35 IC6.10 | v117.47,48.9 118.11,49.53 121.28,46.35 IC5.10 122.56,46.35 v125.73,49.53 | 304.8,32.38 306.07,32.38 307.34,33.66 310.51,33.66 313.69,36.83 313.69,39.37 314.32,40.01 316.87,40.01 321.94,45.09 IC11.10 | 304.8,32.38 302.26,32.38 295.27,25.4 295.27,24.77 IC17.6 294,23.5 292.74,22.23 289.56,22.23 v280.04,12.7 | 304.8,32.38 v304.8,34.92 | v222.25,40.01 230.5,40.01 235.59,45.09 IC4.10 | v254.63,41.91 256.54,43.81 262.25,43.81 263.52,45.09 IC10.10 | v186.06,38.1 186.06,38.73 194.94,47.62 196.22,47.62 198.12,49.53 207.01,49.53 210.19,46.35 IC9.10 | v138.43,43.81 v135.25,40.64 | v143.51,40.01 144.15,40.01 149.22,45.09 IC7.10
  Bottom 0.381: IC6.10 66.04,46.99 67.94,48.9 81.92,48.9 83.19,47.62 92.08,47.62 93.34,46.35 IC3.10 94.61,46.35 97.16,48.9 v117.47,48.9 | v304.8,34.92 295.27,44.45 294.64,44.45 IC2.10 | IC12.10 347.98,44.45 347.98,43.18 351.79,39.37 351.79,36.83 347.98,33.02 344.17,36.83 344.17,39.37 343.54,40.01 328.3,40.01 323.21,45.09 IC11.10 | IC7.10 150.5,46.35 153.67,49.53 162.56,49.53 165.1,46.99 165.1,44.45 165.74,43.81 169.54,43.81 170.18,44.45 170.18,46.99 171.45,48.26 176.53,48.26 178.44,46.35 IC8.10 179.07,44.45 179.71,44.45 v186.06,38.1 | v222.25,40.01 218.44,43.81 212.72,43.81 211.46,45.09 IC9.10 | IC4.10 236.85,45.09 240.03,41.91 v254.63,41.91 255.27,41.27 255.27,36.83 279.4,12.7 v280.04,12.7 | v125.73,49.53 126.36,49.53 v135.25,40.64 | v138.43,43.81 139.7,43.81 v143.51,40.01
SER
  Bottom 0.381: IC1.14 28.57,46.35 27.3,47.62 20.95,47.62 16.51,43.18 SV1.2
TAD  (via drill 0.61)
  Top 0.381: v287.65,9.53 295.91,9.53 311.79,25.4 D40.4
  Bottom 0.381: v287.65,9.53 259.71,37.47 IC10.5
VCC  (via drill 0.61)
  Top 0.762: v27.94,43.18 v39.37,43.18 | v43.81,38.73 IC6.16 | IC9.16 v174.62,24.77 | v207.65,40.64 215.26,40.64 219.71,45.09 220.34,45.09 IC4.16 223.52,48.26 v227.97,48.26 | v263.52,40.64 269.88,40.64 271.78,42.55 274.32,42.55 | 274.32,42.55 276.23,42.55 IC2.16 | IC17.14 IC17.1 | IC11.16 307.34,40.64 305.44,38.73 305.44,37.47 297.18,29.21 294.64,29.21 IC17.4 | v320.68,41.91 321.94,43.18 325.12,43.18 327.02,45.09 332.11,45.09 IC12.16 333.38,46.35 336.55,49.53 349.25,49.53 356.24,42.55 356.24,20.95 VCC1.1 361.31,16.51 362.58,16.51 VCC2.1 | 274.32,42.55 v274.32,40.64 | v231.78,48.26 234.31,48.26 234.95,48.9 242.57,48.9 v244.47,46.99 | v142.24,43.18 v139.7,40.64 | v158.75,40.64 v147.96,40.64 | 68.58,27.3 76.2,19.68 80.64,19.68 100.33,39.37 | 68.58,27.3 66.67,29.21 66.67,30.48 78.74,42.55 IC3.16 | 100.33,39.37 IC5.16 | v44.45,14.61 56.52,14.61 68.58,26.67 68.58,27.3 | 100.33,39.37 102.87,36.83 106.68,40.64 111.76,40.64 112.39,41.27 118.11,41.27 v119.38,42.55 | IC7.16 v131.44,42.55
  Bottom 0.762: v39.37,43.18 v43.81,38.73 | 26.67,43.18 v27.94,43.18 | 26.67,43.18 IC1.16 | 159.38,40.01 163.83,44.45 IC8.16 | v174.62,24.77 159.38,40.01 | v207.65,40.64 200.66,40.64 IC9.16 | v263.52,40.64 259.71,40.64 257.18,43.18 251.46,43.18 IC10.16 248.28,45.72 247.01,46.99 v244.47,46.99 | IC17.4 285.75,20.32 IC17.1 | v320.68,41.91 311.15,41.91 IC11.16 | v274.32,40.64 274.32,39.37 IC17.14 | v227.97,48.26 v231.78,48.26 | v142.24,43.18 142.88,43.18 145.41,40.64 v147.96,40.64 | 159.38,40.01 v158.75,40.64 | v139.7,40.64 IC7.16 | 26.67,43.18 19.68,36.2 19.68,27.3 23.5,23.5 35.56,23.5 v44.45,14.61 | v131.44,42.55 v119.38,42.55
WC
  Top 0.381: IC11.7 323.21,37.47 331.47,29.21 346.07,29.21 346.71,28.57 346.71,27.3 345.44,26.04 D40.30